# EAGLE design H21R2 (EAGLE 9.6.1)

## Sheet 1 of 2
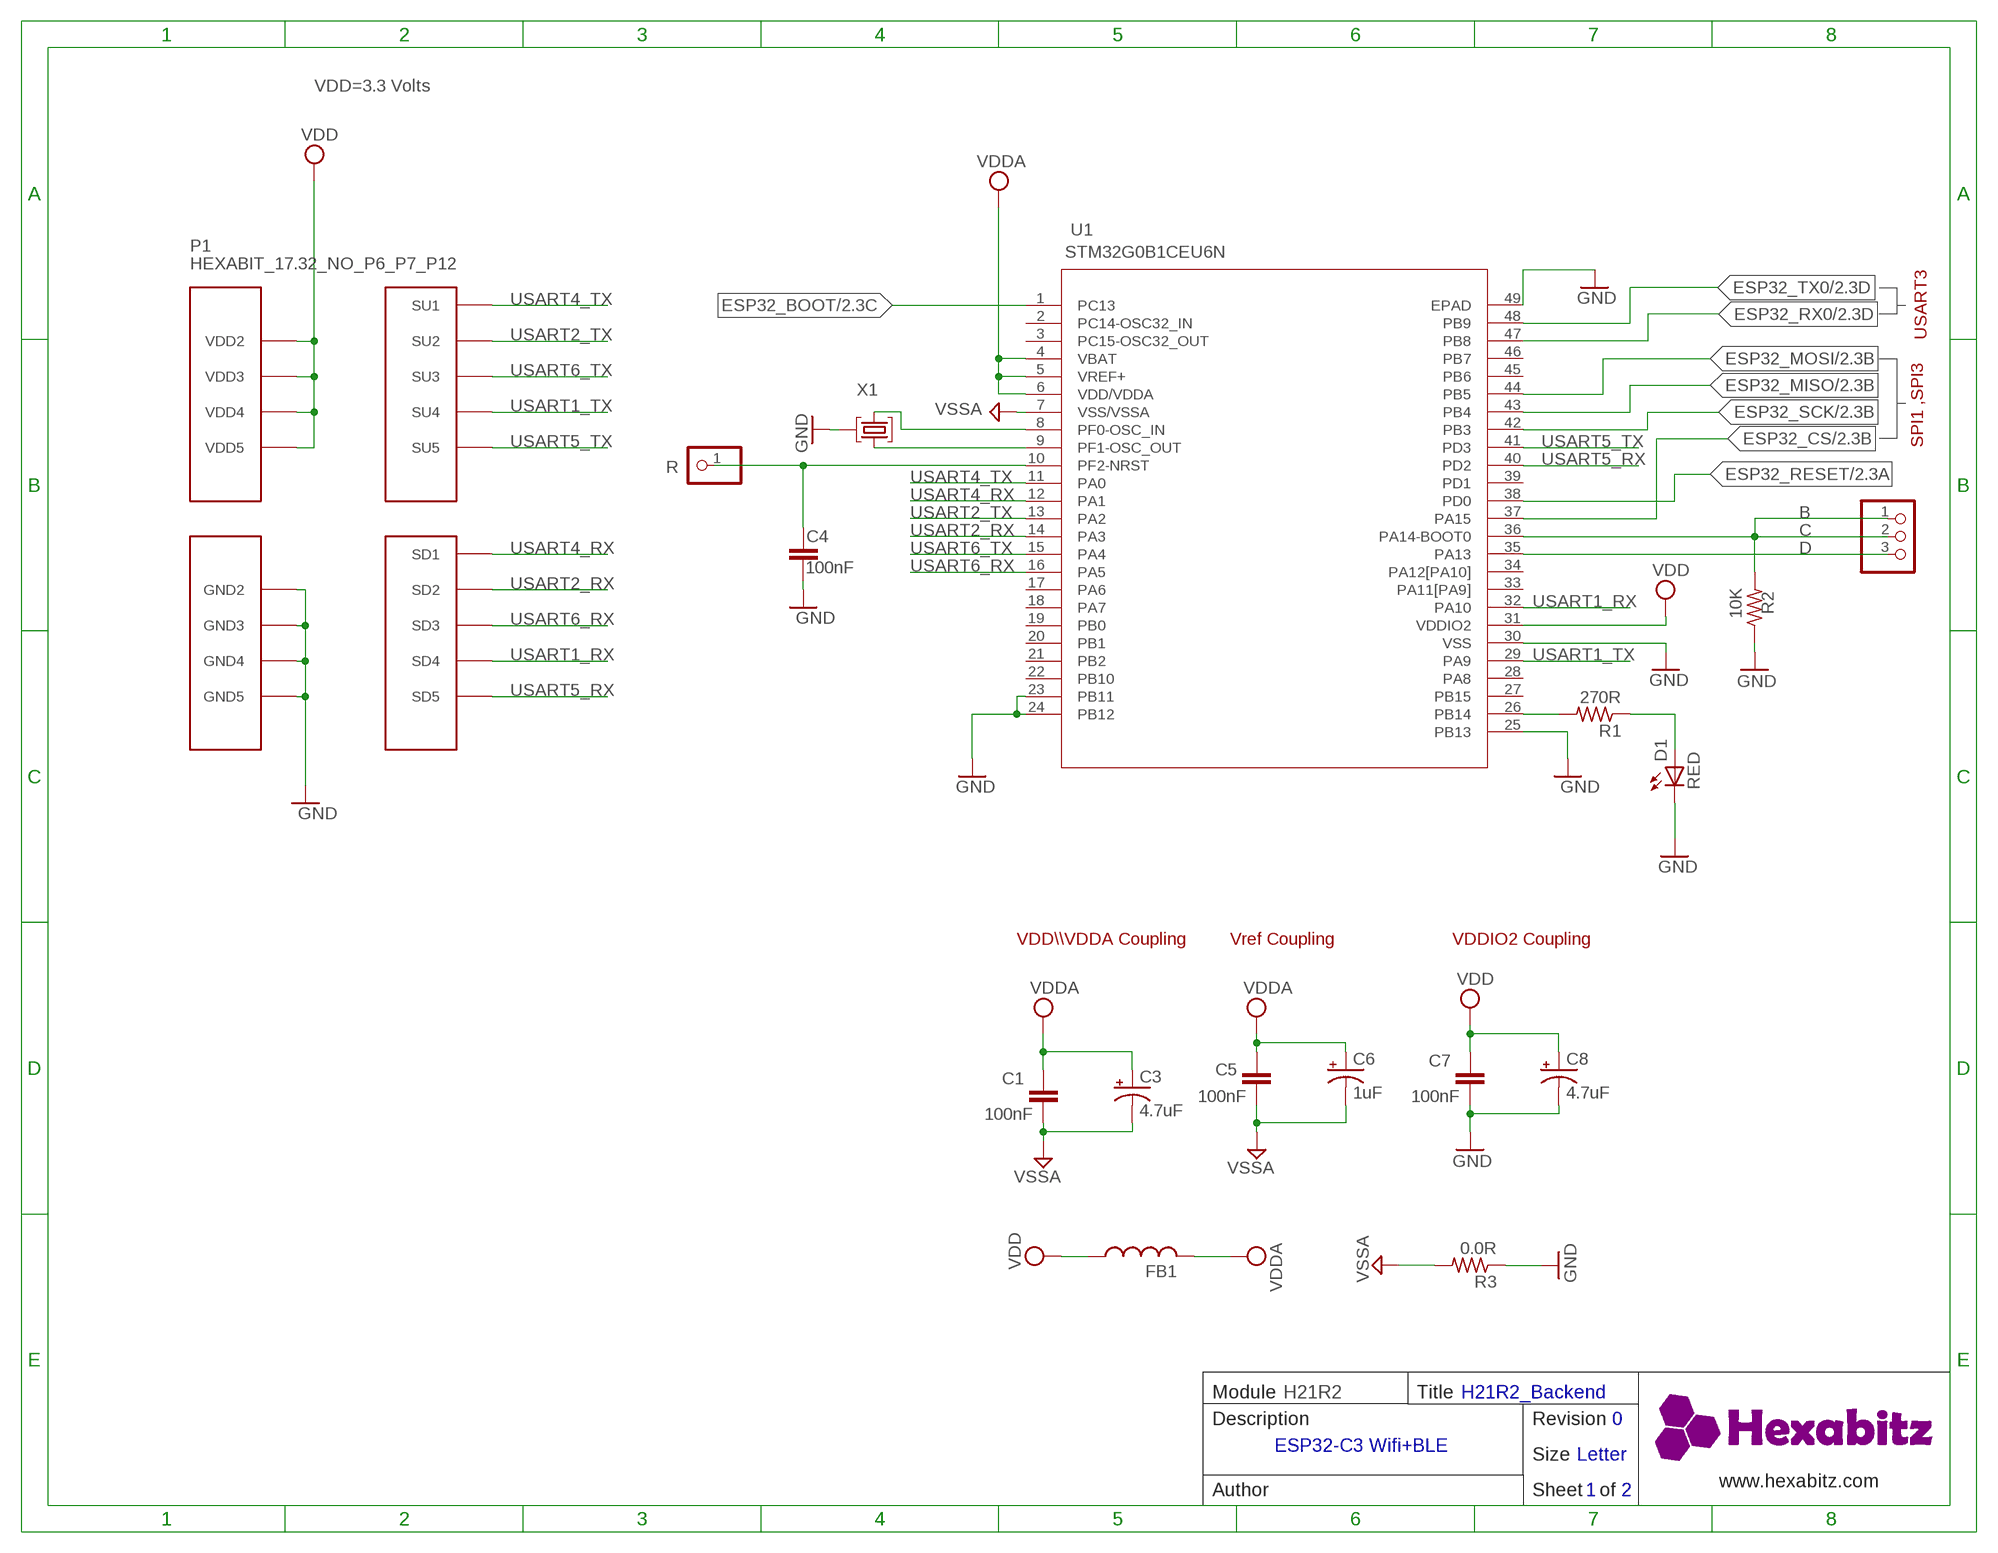
[diagram p0: schematic, sheet 1]

### Parts
C1  100nF  C-0603  [C-0603]
C3  4.7uF  C-0805-POL  [C-0805-POL]
C4  100nF  C-0603  [C-0603]
C5  100nF  C-0603  [C-0603]
C6  1uF  C-0805-POL  [C-0805-POL]
C7  100nF  C-0603  [C-0603]
C8  4.7uF  C-0805-POL  [C-0805-POL]
D1  RED  VLMS1300-GS08  [VLMS1300-GS08]
FB1  FB-TDK_MMZ1608Y300B  [FB-TDK_MMZ1608Y300B]
JP1  PINHD-1X3  [1X03]
P1  HEXABIT_17.32_NO_P6_P7_P12  [HEXABIT_17.32_NO_P6_P7_P12]
R  PINHD-1X1  [1X01]
R1  270R  R-0603  [R-0603]
R2  10K  R-0603  [R-0603]
R3  0.0R  R-0603  [R-0603]
U1  STM32G0B1CEU6N  [HEXABITZ_ICS_QFN_B1CEU6_STM-L]
X1  8MHZ  XTALL_CSTCE8M00G52  [XTALL_CSTCE8M00G52]

### Nets
C: JP1.1 JP1.2 R2.2 U1.36(PA14-BOOT0)
D: JP1.3 U1.35(PA13)
ESP32_BOOT: U1.1(PC13) ; also sheet 2
ESP32_CS: U1.37(PA15) ; also sheet 2
ESP32_MISO: U1.43(PB4) ; also sheet 2
ESP32_MOSI: U1.44(PB5) ; also sheet 2
ESP32_RESET: U1.38(PD0) ; also sheet 2
ESP32_RX0: U1.47(PB8) ; also sheet 2
ESP32_SCK: U1.42(PB3) ; also sheet 2
ESP32_TX0: U1.48(PB9) ; also sheet 2
GND: C4.1 C7.1 C8.2(-) D1.C P1.PAD_PD8(GND2) P1.PAD_PD9(GND3) P1.PAD_PD10(GND4) P1.PAD_PD11(GND5) R2.1 R3.1 U1.23(PB11) U1.24(PB12) U1.25(PB13) U1.30(VSS) U1.49(EPAD) X1.P$2 ; also sheet 2
N$1: U1.8(PF0-OSC_IN) X1.P$1
N$2: U1.9(PF1-OSC_OUT) X1.P$3
N$12: C4.2 R.1 U1.10(PF2-NRST)
N$17: R1.2 U1.26(PB14)
N$19: D1.A R1.1
USART1_RX: P1.PAD_PD4(SD4) U1.32(PA10)
USART1_TX: P1.PAD_PU4(SU4) U1.29(PA9)
USART2_RX: P1.PAD_PD2(SD2) U1.14(PA3)
USART2_TX: P1.PAD_PU2(SU2) U1.13(PA2)
USART4_RX: P1.PAD_PD1(SD1) U1.12(PA1)
USART4_TX: P1.PAD_PU1(SU1) U1.11(PA0)
USART5_RX: P1.PAD_PD5(SD5) U1.40(PD2)
USART5_TX: P1.PAD_PU5(SU5) U1.41(PD3)
USART6_RX: P1.PAD_PD3(SD3) U1.16(PA5)
USART6_TX: P1.PAD_PU3(SU3) U1.15(PA4)
VDD: C7.2 C8.1(+) FB1.1 P1.PAD_PU8(VDD2) P1.PAD_PU9(VDD3) P1.PAD_PU10(VDD4) P1.PAD_PU11(VDD5) U1.31(VDDIO2) ; also sheet 2
VDDA: C1.2 C3.1(+) C5.2 C6.1(+) FB1.2 U1.4(VBAT) U1.5(VREF+) U1.6(VDD/VDDA)
VSSA: C1.1 C3.2(-) C5.1 C6.2(-) R3.2 U1.7(VSS/VSSA)
Unconnected: U1.2(PC14-OSC32_IN) U1.3(PC15-OSC32_OUT) U1.17(PA6) U1.18(PA7) U1.19(PB0) U1.20(PB1) U1.21(PB2) U1.22(PB10) U1.27(PB15) U1.28(PA8) U1.33(PA11[PA9]) U1.34(PA12[PA10]) U1.39(PD1) U1.45(PB6) U1.46(PB7)

### Notes on the sheet
- VDD=3.3 Volts
- USART3
- SPI1 ,SPI3
- B
- VDD\\\VDDA Coupling | Vref Coupling | VDDIO2 Coupling
- Module | H21R2 | Title | H21R2_Backend
- Description | Revision | 0
- ESP32-C3 Wifi+BLE
- Size | Letter
- www.hexabitz.com
- Author | Sheet   of | 1 | 2
- C:/Users/Admin/Desktop/logodraft.bmp

## Sheet 2 of 2
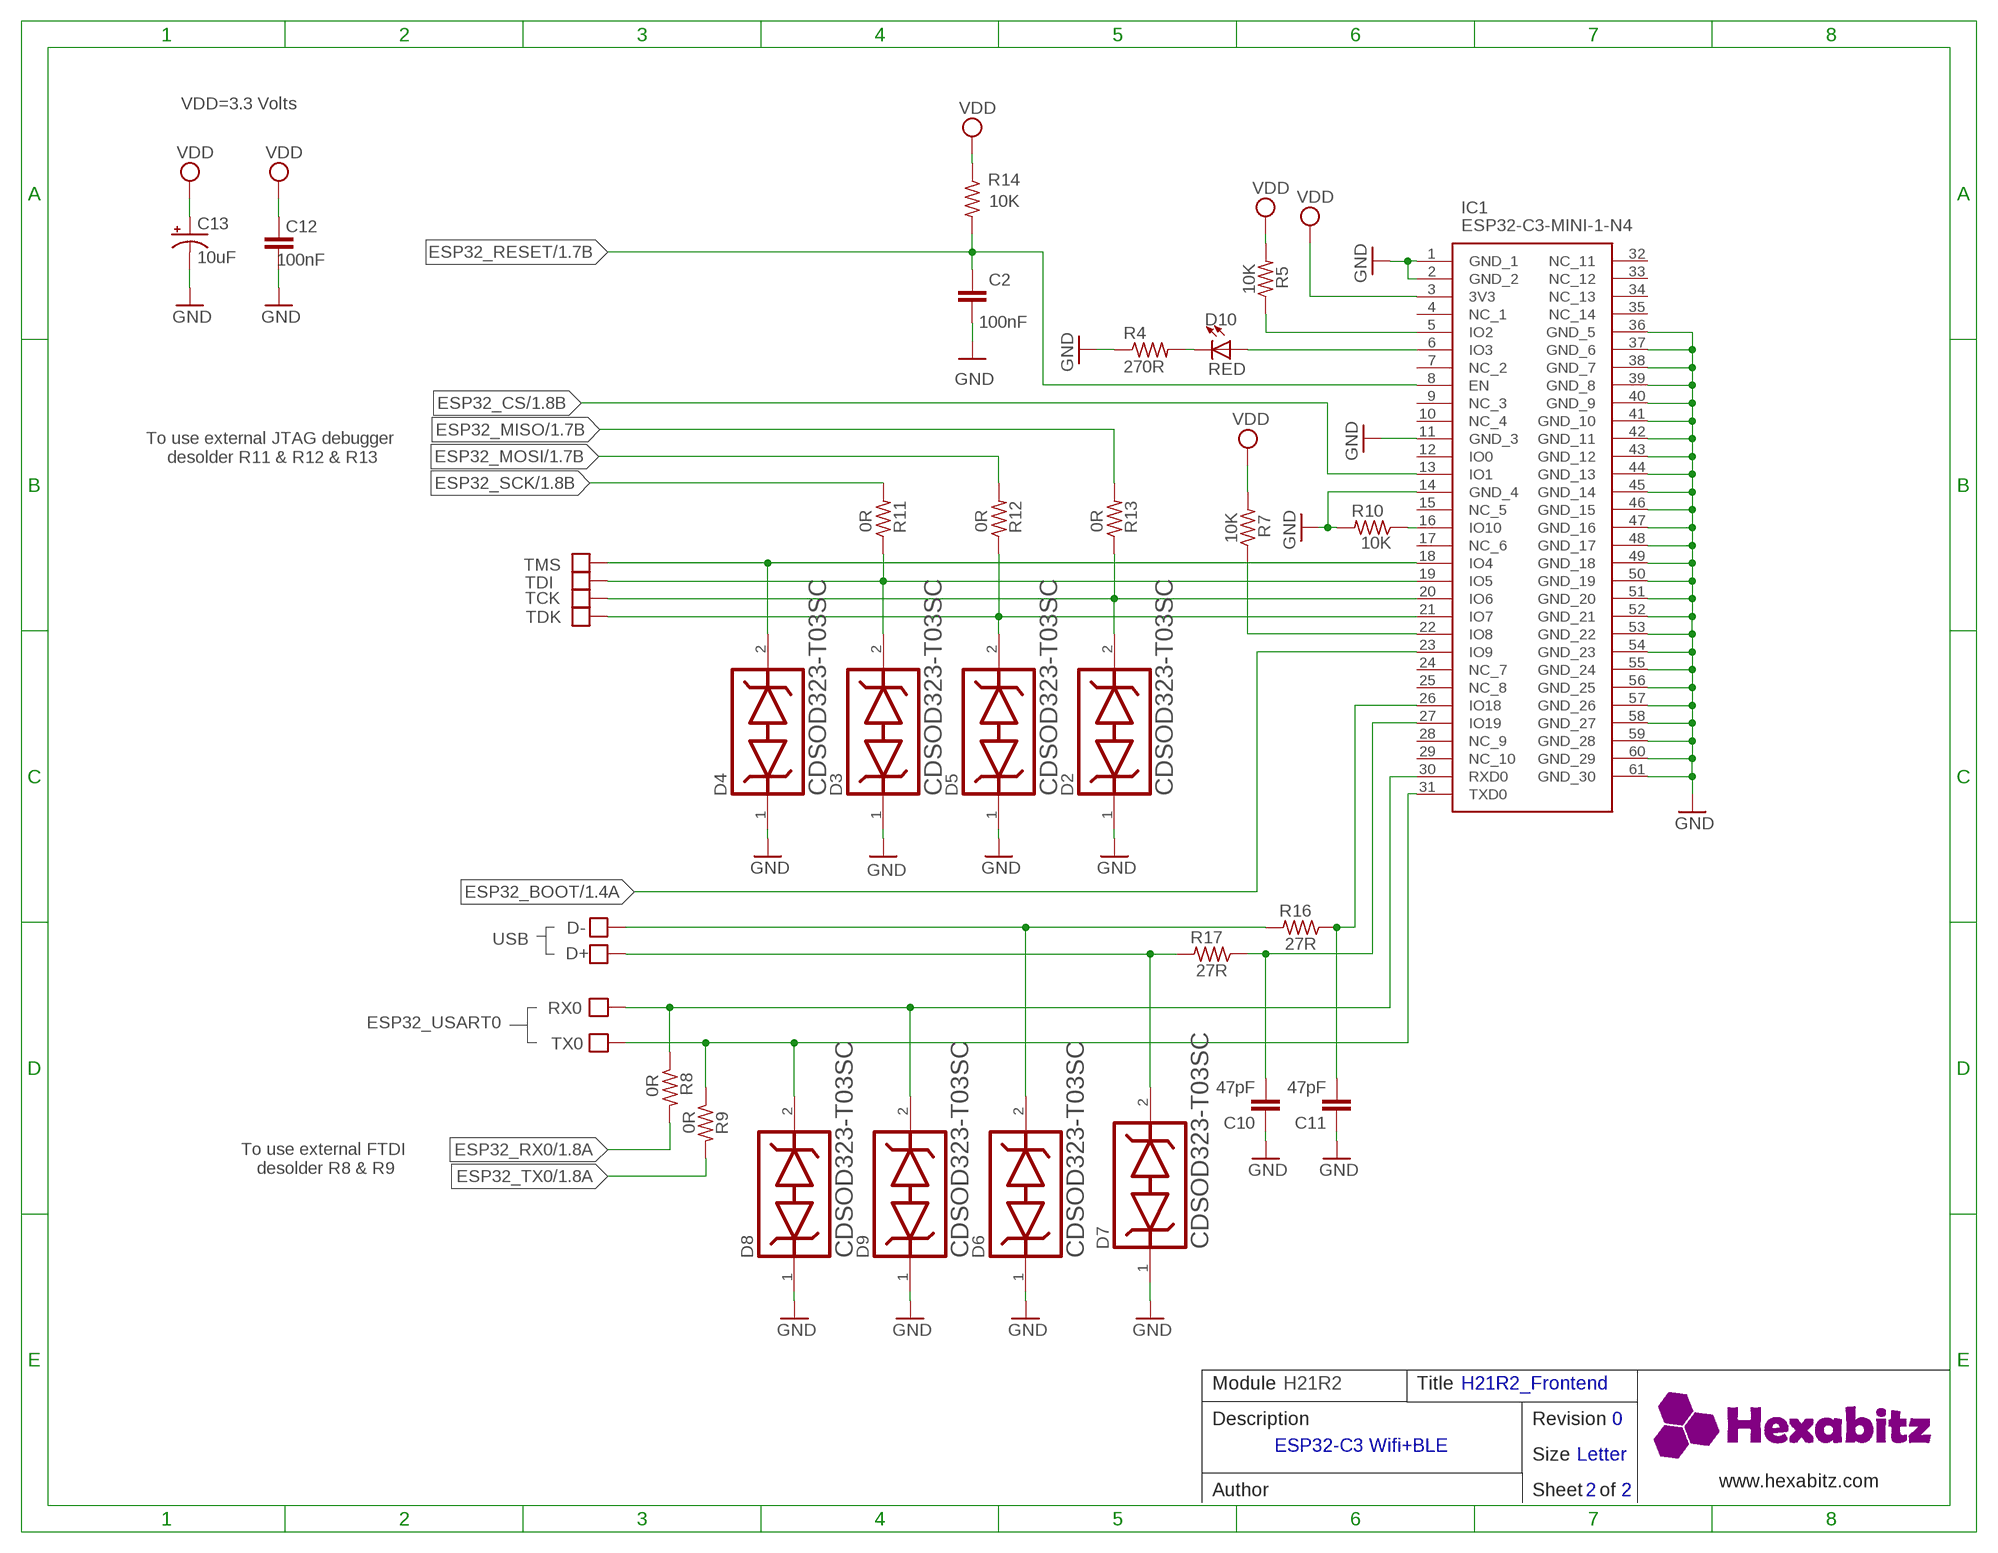
[diagram p1: schematic, sheet 2]

### Parts
C2  100nF  C-0603  [C-0603]
C10  47pF  C-0603  [C-0603]
C11  47pF  C-0603  [C-0603]
C12  100nF  C-0603  [C-0603]
C13  10uF  C-1210-POL  [C-1210-POL]
D2  BOURNS_CDSOD323-T03SCBOURNS_CDSOD323-T03SC_0_0  [BOURNS_CDSOD323-T03SC_0]
D3  BOURNS_CDSOD323-T03SCBOURNS_CDSOD323-T03SC_0_0  [BOURNS_CDSOD323-T03SC_0]
D4  BOURNS_CDSOD323-T03SCBOURNS_CDSOD323-T03SC_0_0  [BOURNS_CDSOD323-T03SC_0]
D5  BOURNS_CDSOD323-T03SCBOURNS_CDSOD323-T03SC_0_0  [BOURNS_CDSOD323-T03SC_0]
D6  BOURNS_CDSOD323-T03SCBOURNS_CDSOD323-T03SC_0_0  [BOURNS_CDSOD323-T03SC_0]
D7  BOURNS_CDSOD323-T03SCBOURNS_CDSOD323-T03SC_0_0  [BOURNS_CDSOD323-T03SC_0]
D8  BOURNS_CDSOD323-T03SCBOURNS_CDSOD323-T03SC_0_0  [BOURNS_CDSOD323-T03SC_0]
D9  BOURNS_CDSOD323-T03SCBOURNS_CDSOD323-T03SC_0_0  [BOURNS_CDSOD323-T03SC_0]
D10  RED  VLMS1300-GS08  [VLMS1300-GS08]
D+  PAD4  [PAD4]
D-  PAD4  [PAD4]
IC1  ESP32-C3-MINI-1-N4  [ESP32C3MINI1N4]
R4  270R  R-0603  [R-0603]
R5  10K  R-0603  [R-0603]
R7  10K  R-0603  [R-0603]
R8  0R  R-0603  [R-0603]
R9  0R  R-0603  [R-0603]
R10  10K  R-0603  [R-0603]
R11  0R  R-0402  [R-0402]
R12  0R  R-0402  [R-0402]
R13  0R  R-0402  [R-0402]
R14  10K  R-0603  [R-0603]
R16  27R  R-0603  [R-0603]
R17  27R  R-0603  [R-0603]
RX0  PAD4  [PAD4]
TCK  PAD4  [PAD4]
TDI  PAD4  [PAD4]
TDK  PAD4  [PAD4]
TMS  PAD4  [PAD4]
TX0  PAD4  [PAD4]

### Nets
D_N: D6.2 D-.P$1 R16.2
D_P: D7.2 D+.P$1 R17.2
DATA_N: C11.2 IC1.26(IO18) R16.1
DATA_P: C10.2 IC1.27(IO19) R17.1
ESP32_BOOT: IC1.23(IO9) ; also sheet 1
ESP32_CS: IC1.13(IO1) ; also sheet 1
ESP32_MISO: R13.2 ; also sheet 1
ESP32_MOSI: R12.2 ; also sheet 1
ESP32_RESET: C2.2 IC1.8(EN) R14.2 ; also sheet 1
ESP32_RX0: R8.2 ; also sheet 1
ESP32_SCK: R11.2 ; also sheet 1
ESP32_TX0: R9.2 ; also sheet 1
GND: C2.1 C10.1 C11.1 C12.1 C13.2(-) D2.1 D3.1 D4.1 D5.1 D6.1 D7.1 D8.1 D9.1 IC1.1(GND_1) IC1.2(GND_2) IC1.11(GND_3) IC1.14(GND_4) IC1.36(GND_5) IC1.37(GND_6) IC1.38(GND_7) IC1.39(GND_8) IC1.40(GND_9) IC1.41(GND_10) IC1.42(GND_11) IC1.43(GND_12) IC1.44(GND_13) IC1.45(GND_14) IC1.46(GND_15) IC1.47(GND_16) IC1.48(GND_17) IC1.49(GND_18) IC1.50(GND_19) IC1.51(GND_20) IC1.52(GND_21) IC1.53(GND_22) IC1.54(GND_23) IC1.55(GND_24) IC1.56(GND_25) IC1.57(GND_26) IC1.58(GND_27) IC1.59(GND_28) IC1.60(GND_29) IC1.61(GND_30) R4.1 R10.2 ; also sheet 1
N$3: D4.2 IC1.18(IO4) TMS.P$1
N$4: IC1.22(IO8) R7.1
N$5: D10.C R4.2
N$6: D9.2 IC1.30(RXD0) R8.1 RX0.P$1
N$7: D8.2 IC1.31(TXD0) R9.1 TX0.P$1
N$9: IC1.16(IO10) R10.1
N$10: D2.2 IC1.20(IO6) R13.1 TCK.P$1
N$11: D5.2 IC1.21(IO7) R12.1 TDK.P$1
N$14: D10.A IC1.6(IO3)
N$15: IC1.5(IO2) R5.1
N$18: D3.2 IC1.19(IO5) R11.1 TDI.P$1
VDD: C12.2 C13.1(+) IC1.3(3V3) R5.2 R7.2 R14.1 ; also sheet 1
Unconnected: IC1.4(NC_1) IC1.7(NC_2) IC1.9(NC_3) IC1.10(NC_4) IC1.12(IO0) IC1.15(NC_5) IC1.17(NC_6) IC1.24(NC_7) IC1.25(NC_8) IC1.28(NC_9) IC1.29(NC_10) IC1.32(NC_11) IC1.33(NC_12) IC1.34(NC_13) IC1.35(NC_14)

### Notes on the sheet
- VDD=3.3 Volts
- To use external JTAG debugger
   desolder R11 & R12 & R13
- USB
- ESP32_USART0
- To use external FTDI
   desolder R8 & R9
- Module | H21R2 | Title | H21R2_Frontend
- Description | Revision | 0
- ESP32-C3 Wifi+BLE
- Size | Letter
- www.hexabitz.com
- Author | Sheet   of | 2 | 2

## Library data of the parts
C1 C2 C5 C7 C10-C12 = HEXABITZ_RCLS:C-0603: CAP CER 10% X7R 0603; CAPACITANCE: 100nF; MFN: AVX CORPORATION; MPN: '0603YC104K4T2A; OCTOPART_URL: 'https://octopart.com/0603yc104k4t2a-avx+interconnect+%2F+elco-8120651; TOLERANCE: 10%; VOLTAGE_RATING: 16.0 V
C3 = HEXABITZ_RCLS:C-0805-POL: Cap Tant Solid SMD 2012; CAPACITANCE: 4.7uF; MFN: 'Panasonic; MPN: '10TPU4R7MSI; OCTOPART_URL: https://octopart.com/10tpu4r7msi-panasonic-29487748?r=sp; TOLERANCE: 20%; VOLTAGE_RATING: 10.0 V
C4 = HEXABITZ_RCLS:C-0603: CAP CER 10% X7R 0603; CAPACITANCE: 100nF; MFN: AVX CORPORATION; MPN: 0603YC104K4T2A; OCTOPART_URL: 'https://octopart.com/0603yc104k4t2a-avx+interconnect+%2F+elco-8120651; TOLERANCE: 10%; VOLTAGE_RATING: 16.0 V
C6 = HEXABITZ_RCLS:C-0805-POL: Cap Tant Solid SMD 2012; CAPACITANCE: 4.7uF; MFN: 'YAGEO [VA]; MPN: 'CC0805KKX7R7BB105; OCTOPART_URL: 'https://octopart.com/cc0805kkx7r7bb105-yageo-8376555?r=sp; TOLERANCE: 20%; VOLTAGE_RATING: 10.0 V
C8 = HEXABITZ_RCLS:C-0805-POL: Cap Tant Solid SMD 2012; CAPACITANCE: 1.00uF; MFN: 'Panasonic; MPN: '10TPU4R7MSI; OCTOPART_URL: https://octopart.com/10tpu4r7msi-panasonic-29487748?r=sp; TOLERANCE: 10%; VOLTAGE_RATING: 16.0 V
C13 = HEXABITZ_RCLS:C-1210-POL: Cap Tant Solid SMD 1210 Pol
D1 D10 = HEXABITZ_USER_INTERFACE_PARTS:VLMS1300-GS08: Red 0603 130° Clear 54 mcd 2 V Surface Mount ChipLED ; Octopart Url : http://octopart.com/vlms1300-gs08-vishay-21709201; MFN: Vishay; MPN: VLMS1300-GS08; OCTOPART_URL: https://octopart.com/vlms1300-gs08-vishay-21709201?r=sp&s=0nXJNjGsSbWwqfqWlZv0EA
D2-D9 = HEXABITZ_RCLS:BOURNS_CDSOD323-T03SC: CDSOD323-TxxSC - TVS Diode Series; DESCRIPTION: Dio Tvs Vwm 03V 500W Bidir Sod323 / Tape & Reel - 7" Reel; MFN: Bourns; MPN: CDSOD323-T03SC; OCTOPART_URL: https://octopart.com/cdsod323-t03sc-bourns-10487153?r=sp
D+ D- RX0 TCK TDI TDK TMS TX0 = HEXABITZ_CONNECTION_PARTS:PAD4
FB1 = HEXABITZ_RCLS:FB-TDK_MMZ1608Y300B: Ferrite Beads Multi-Layer 30Ohm 25% 100MHz 1.5A 50mOhm DCR 0603; MFN: TDK; MPN: MMZ1608Y300BTA00; OCTOPART_URL: https://octopart.com/mmz1608y300bta00-tdk-7906990?r=sp
IC1 = HEXABITZ_ICs:ESP32-C3-MINI-1-N4: SMD MODULE, ESP32-C3FN4, PCB ANT Source: Datasheet <https://www.mouser.com/datasheet/2/891/Espressif_ESP32_C3_MINI_1_Datasheet-2006822.pdf>; DESCRIPTION: SMD MODULE, ESP32-C3FN4, PCB ANT; HEIGHT: 2.55mm; MANUFACTURER_NAME: Espressif Systems; MANUFACTURER_PART_NUMBER: ESP32-C3-MINI-1-N4; MOUSER_PART_NUMBER: 356-ESP32-C3-MINI1N4; MOUSER_PRICE-STOCK: https://www.mouser.co.uk/ProductDetail/Espressif-Systems/ESP32-C3-MINI-1-N4?qs=stqOd1AaK7%252B%2FpH3qqyGehA%3D%3D
JP1 = pinhead:PINHD-1X3: PIN HEADER
P1 = hexabitz_connectors:HEXABIT_?_NO_P6_P7_P12: Hexabitz Hexagon Module Connector Hexagon side length = 17.32mm. The following ports are removed: P6 P7 P12
R = HEXABITZ_USER_INTERFACE_PARTS:PINHD-1X1: PIN HEADER; MFN: TE Connectivity; MPN: 87227-1; OCTOPART_URL: https://octopart.com/87227-1-te+connectivity-39512052?r=sp
R1 R4 = HEXABITZ_RCLS:R-0603: Thick Film Resistors - SMD 0603; MFN: 'Panasonic; MPN: 'ERJ-3GEYJ271V; OCTOPART_URL: https://octopart.com/erj-3geyj271v-panasonic-55560546?r=sp; RESISTANCE: 270R
R2 = HEXABITZ_RCLS:R-0603: Thick Film Resistors - SMD 0603; MFN: Vishay; MPN: '060300J0103T5E; OCTOPART_URL: https://octopart.com/search?q=060300J0103T5E&currency=USD&specs=0; RESISTANCE: 10K
R3 R5 R7-R10 R14 R16 R17 = HEXABITZ_RCLS:R-0603: Thick Film Resistors - SMD 0603; MFN: YAGEO [VR]; MPN: RC0603JR-070RL; OCTOPART_URL: https://octopart.com/rc0603jr-070rl-yageo-1241539?r=sp; RESISTANCE: 0R
R11-R13 = HEXABITZ_RCLS:R-0402: Thick Film Resistors - SMD 0603; MFN: YAGEO [VR]; MPN: RC0603JR-070RL; OCTOPART_URL: https://octopart.com/rc0603jr-070rl-yageo-1241539?r=sp; RESISTANCE: 0R
U1 = HEXABITZ_ICs:STM32G0B1CEU6N
X1 = HEXABITZ_OTHER_PARTS:XTALL_CSTCE8M00G52: MURATA CSTCE8M00G52-R0 RESONATOR, SMD, 8MHZ ; Octopart Url : https://octopart.com/cstce8m00g52-r0-murata-7145559; MFN: Murata; MPN: CSTNE8M00G550000R0; OCTOPART_URL: https://octopart.com/cstne8m00g550000r0-murata-91406934?r=sp

## Board
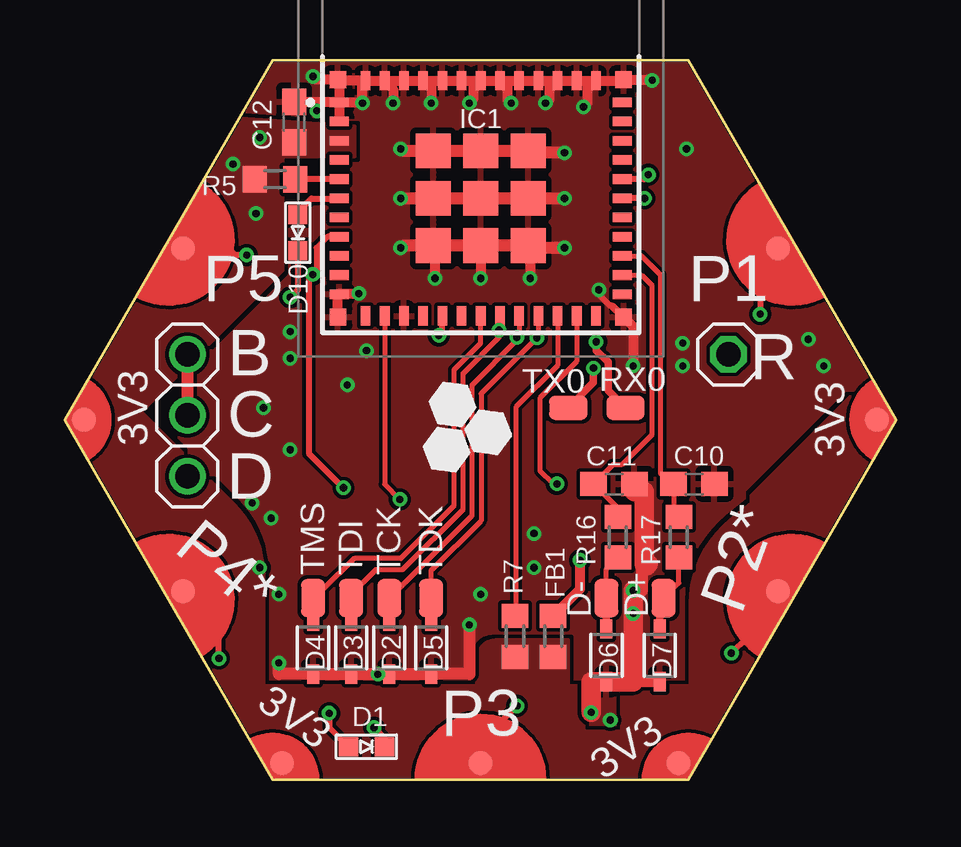
[diagram p2: board, top side]
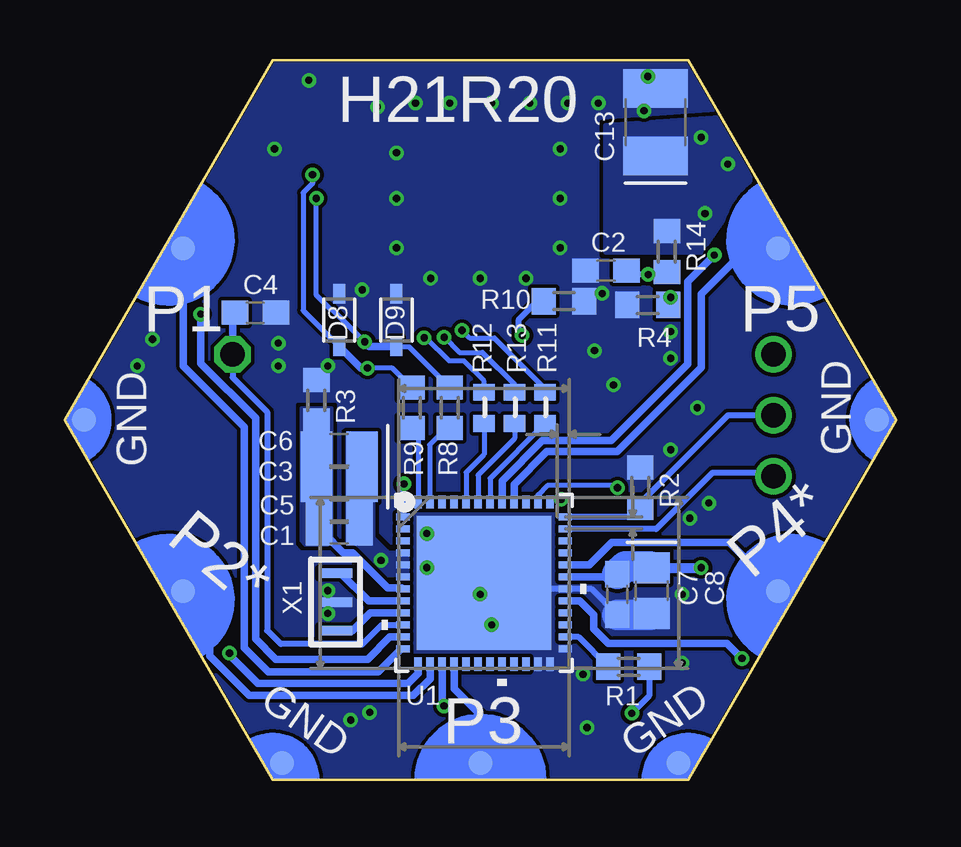
[diagram p3: board, bottom side, seen from below]

Size 34.64 x 30 mm. Coordinates in mm from the lower left corner, seen from the top.
Copper layers (1*16): Top 0.035mm / dielectric 1.5mm / Bottom 0.035mm
Design rules "2_layer *": minimum track width 6mil, minimum drill 10mil, track to track 6mil, track to pad 6mil, pad to pad 6mil, via to via 6mil, smd to smd 0mil, copper to edge 1mil, drill to drill 8mil, minimum pad ring 10mil, minimum via ring 6mil, stop-mask expansion 2mil, vias tented up to drill 15mil, thermal gap 10mil

### Footprints (pad centres in the part's own frame; a part is rotated, then mirrored left to right if it is on the bottom)
C-0603 = smd 1.1 x 1: 1 -0.85,0; 2 0.85,0
C-0805-POL = smd 1.3 x 1.5: 1 -0.95,0; 2 0.95,0
C-1210-POL = smd 1.6 x 2.7: 1 -1.4,0; 2 1.4,0
VLMS1300-GS08 = smd 0.8 x 0.8: A 0,0.75; C 0,-0.75
BOURNS_CDSOD323-T03SC_0 = smd 0.8 x 0.5: 1 -1.1,0; 2 1.1,0
PAD4 = smd 1.6 x 1: P$1 0,0
FB-TDK_MMZ1608Y300B = smd 1 x 1.1: 1 -0.85,0; 2 0.85,0
ESP32C3MINI1N4 = smd 0.8 x 0.4: 1 -5.9,4; 2 -5.9,3.2; 3 -5.9,2.4; 4 -5.9,1.6; 5 -5.9,0.8; 6 -5.9,0; 7 -5.9,-0.8; 8 -5.9,-1.6; 9 -5.9,-2.4; 10 -5.9,-3.2; 11 -5.9,-4; 25 5.9,-4; 26 5.9,-3.2; 27 5.9,-2.4; 28 5.9,-1.6; 29 5.9,-0.8; 30 5.9,0; 31 5.9,0.8; 32 5.9,1.6; 33 5.9,2.4; 34 5.9,3.2; 35 5.9,4 | smd 0.4 x 0.8: 12 -4.8,-4.9; 13 -4,-4.9; 14 -3.2,-4.9; 15 -2.4,-4.9; 16 -1.6,-4.9; 17 -0.8,-4.9; 18 0,-4.9; 19 0.8,-4.9; 20 1.6,-4.9; 21 2.4,-4.9; 22 3.2,-4.9; 23 4,-4.9; 24 4.8,-4.9; 36 4.8,4.9; 37 4,4.9; 38 3.2,4.9; 39 2.4,4.9; 40 1.6,4.9; 41 0.8,4.9; 42 0,4.9; 43 -0.8,4.9; 44 -1.6,4.9; 45 -2.4,4.9; 46 -3.2,4.9; 47 -4,4.9; 48 -4.8,4.9 | smd 1.45 x 1.45: 49 0,0; 50 1.975,1.975; 51 0,1.975; 52 -1.975,1.975; 53 -1.975,0; 54 -1.975,-1.975; 55 0,-1.975; 56 1.975,-1.975; 57 1.975,0 | smd 0.7 x 0.7: 58 -5.95,4.95; 59 -5.95,-4.95; 60 5.95,-4.95; 61 5.95,4.95
1X03 = drill 1.016: 1 -2.54,0; 2 0,0; 3 2.54,0
HEXABIT_17.32_NO_P6_P7_P12 = smd 1 x 1 bottom: PAD_PD1 12.39,7.15; PAD_PD2 12.39,-7.15; PAD_PD3 0,-14.31; PAD_PD4 -12.39,-7.15; PAD_PD5 -12.39,7.15; PAD_PD8 16.52,0; PAD_PD9 8.26,-14.31; PAD_PD10 -8.26,-14.31; PAD_PD11 -16.52,0 | smd 1 x 1: PAD_PU1 12.39,7.15; PAD_PU2 12.39,-7.15; PAD_PU3 0,-14.31; PAD_PU4 -12.39,-7.15; PAD_PU5 -12.39,7.15; PAD_PU8 16.52,0; PAD_PU9 8.26,-14.31; PAD_PU10 -8.26,-14.31; PAD_PU11 -16.52,0
1X01 = drill 1.016 octagon: 1 0,0
R-0603 = smd 1 x 1.1: 1 -0.85,0; 2 0.85,0
R-0402 = smd 0.7 x 0.9: 1 -0.65,0; 2 0.65,0
HEXABITZ_ICS_QFN_B1CEU6_STM-L = smd 0.55 x 0.297: 1 -3.38,2.751; 2 -3.38,2.251; 3 -3.38,1.75; 4 -3.38,1.25; 5 -3.38,0.75; 6 -3.38,0.25; 7 -3.38,-0.25; 8 -3.38,-0.75; 9 -3.38,-1.25; 10 -3.38,-1.75; 11 -3.38,-2.251; 12 -3.38,-2.751; 25 3.38,-2.751; 26 3.38,-2.251; 27 3.38,-1.75; 28 3.38,-1.25; 29 3.38,-0.75; 30 3.38,-0.25; 31 3.38,0.25; 32 3.38,0.75; 33 3.38,1.25; 34 3.38,1.75; 35 3.38,2.251; 36 3.38,2.751 | smd 0.297 x 0.55: 13 -2.751,-3.38; 14 -2.251,-3.38; 15 -1.75,-3.38; 16 -1.25,-3.38; 17 -0.75,-3.38; 18 -0.25,-3.38; 19 0.25,-3.38; 20 0.75,-3.38; 21 1.25,-3.38; 22 1.75,-3.38; 23 2.251,-3.38; 24 2.751,-3.38; 37 2.751,3.38; 38 2.251,3.38; 39 1.75,3.38; 40 1.25,3.38; 41 0.75,3.38; 42 0.25,3.38; 43 -0.25,3.38; 44 -0.75,3.38; 45 -1.25,3.38; 46 -1.75,3.38; 47 -2.251,3.38; 48 -2.751,3.38 | smd 5.6 x 5.6: 49 0,0
XTALL_CSTCE8M00G52 = smd 1.4 x 0.4: P$1 0,1.2; P$2 0,0; P$3 0,-1.2

### Placement (x,y rotation side)
C1  23.2,10.26 0 bottom
C2  12.09,21.21 0 bottom
C3  23.2,12.32 180 bottom
C4  26.7,19.47 180 bottom
C5  23.2,11.21 0 bottom
C6  23.2,13.75 180 bottom
C7  11.62,7.72 90 bottom
C8  10.19,7.88 270 bottom
C10  26.22,12.32 180 top
C11  22.89,12.32 180 top
C12  9.55,27.41 270 top
C13  10.03,27.41 90 bottom
D1  12.57,1.37 90 top
D2  13.52,5.5 90 top
D3  11.93,5.5 90 top
D4  10.35,5.5 90 top
D5  15.27,5.5 90 top
D6  22.57,5.18 90 top
D7  24.79,5.18 90 top
D8  23.2,19.15 270 bottom
D9  20.82,19.15 270 bottom
D10  9.71,22.8 0 top
D+  24.95,7.56 90 top
D-  22.57,7.56 90 top
FB1  20.35,5.97 90 top
IC1  17.33,24.23 0 top
JP1  5.11,15.18 270 top
P1  17.32,15 0 top
R  27.65,17.72 180 top
R1  11.14,4.7 180 bottom
R2  10.66,12.17 270 bottom
R3  24.16,15.82 270 bottom
R4  10.35,19.79 0 bottom
R5  8.76,25.02 180 top
R7  18.76,5.97 270 top
R8  18.6,15.5 270 bottom
R9  20.19,15.5 270 bottom
R10  13.84,19.94 0 bottom
R11  14.63,15.5 270 bottom
R12  17.17,15.5 270 bottom
R13  15.9,15.5 270 bottom
R14  9.55,22.01 270 bottom
R16  23.05,10.1 270 top
R17  25.59,10.1 270 top
RX0  23.36,15.5 180 top
TCK  13.52,7.56 90 top
TDI  11.93,7.56 270 top
TDK  15.27,7.56 90 top
TMS  10.35,7.56 90 top
TX0  20.98,15.5 0 top
U1  17.17,8.2 0 bottom
X1  23.36,7.4 0 bottom

### Tracks (layer width: path | path; a pad name or v marks a point on that pad's centre or on a via)
C
  Top 0.508: JP1.1 JP1.2
  Bottom 0.254: JP1.2 7.01,15.18 10.66,11.53 R2.2 11.03,10.95 U1.36
D
  Bottom 0.254: JP1.3 5.27,12.8 7.65,12.8 10,10.45 U1.35
D_N
  Top 0.203: D-.P$1 22.57,8.78 R16.2
  Top 0.305: D-.P$1 D6.2
D_P
  Top 0.203: D+.P$1 25.59,8.2 R17.2
  Top 0.305: D+.P$1 24.79,7.4 D7.2
DATA_N
  Top 0.203: IC1.26 24.04,21.03 24.47,20.59 24.47,14.39 23.2,13.12 22.83,13.12 C11.2 23.05,11.32 R16.1
DATA_P
  Top 0.203: IC1.27 24.04,21.83 24.83,21.04 24.83,12.77 25.27,12.32 C10.2 25.37,11.17 R17.1
ESP32_BOOT  (via drill 0.3 pad 0.55)
  Top 0.203: IC1.23 21.33,17.44 19.8,15.91 19.8,12.87 20.35,12.32 v20.51,12.32
  Bottom 0.254: v20.51,12.32 20.57,12.26 20.57,10.95 U1.1
ESP32_CS  (via drill 0.3 pad 0.55)
  Top 0.203: v13.96,11.68 13.33,12.32 IC1.13
  Bottom 0.254: v13.96,11.68 14.42,11.68 U1.37
ESP32_MISO
  Bottom 0.203: R13.2 15.9,14.21 17.42,12.69 U1.43
ESP32_MOSI
  Bottom 0.203: R12.2 17.17,13.56 17.92,12.81 U1.44
ESP32_RESET  (via drill 0.3 pad 0.55)
  Top 0.254: IC1.8 10.95,22.63 10.49,22.17 10.49,21.21 v10.33,21.06 10.17,20.9 10.17,13.6 v11.61,12.16
  Bottom 0.203: v11.61,12.16 11.7,12.25 14.54,12.25 14.92,11.87 U1.38
  Bottom 0.254: R14.2 10.23,21.16 v10.33,21.06 11.08,21.06 C2.2
ESP32_RX0
  Bottom 0.203: R8.2 18.76,14.65 19.44,13.97 19.44,11.59 U1.47
ESP32_SCK
  Bottom 0.203: R11.2 16.92,12.56 U1.42
ESP32_TX0
  Bottom 0.203: R9.2 19.92,14.38 U1.48
GND  (via drill 0.3 pad 0.55)
  Top 0.254: 22.84,19.73 22.81,19.75 22.71,19.75 22.25,20.21 v22.25,20.42 | v12.89,2.16 13.32,1.73 D1.C
  Top 0.305: IC1.60 22.84,19.73
  Top 0.406: IC1.48 IC1.47 | IC1.47 IC1.46 IC1.45 15.27,29.13 | 15.27,29.13 IC1.44 IC1.43 17.01,29.13 | 17.01,29.13 IC1.42 IC1.41 18.44,29.13 | 18.44,29.13 IC1.40 IC1.39 20.19,29.13 | 20.19,29.13 IC1.38 IC1.37 21.78,29.13 | 21.78,29.13 IC1.36 23.23,29.13 IC1.61 24.45,29.18 v24.47,29.15 | IC1.48 11.43,29.13 | v10.35,29.31 10.48,29.18 IC1.58 11.43,29.13 | 11.43,29.13 IC1.1 | IC1.1 IC1.2 | IC1.1 12.38,28.23 | 12.38,28.23 v12.41,28.2 | IC1.48 12.38,28.98 12.38,28.23 | IC1.47 13.68,28.78 v13.68,28.2 | 15.27,29.13 v15.27,28.2 | 17.01,29.13 17.01,28.36 v16.85,28.2 | 18.44,29.13 18.44,28.36 v18.6,28.2 | 20.19,29.13 20.19,28.36 v20.03,28.2 | 21.78,29.13 21.78,28.2 v21.62,28.04 | C12.1 11.41,28.26 IC1.1 | IC1.59 11.38,20.18 IC1.11 11.46,20.26 v12.25,20.26 | IC1.60 23.68,18.88 v23.68,17.25 | IC1.54 15.43,22.19 v15.43,20.9 | IC1.55 v17.33,20.9 | 19.39,22.17 v19.39,20.9 | D6.1 22.73,4.08 D7.1
  Top 0.508: v20.82,26.14 19.38,26.14 IC1.50 IC1.51 IC1.52 14.09,26.21 v14,26.29 | v14,24.23 IC1.53 IC1.49 IC1.57 v20.82,24.23 | v20.82,22.17 19.39,22.17 IC1.56 IC1.55 IC1.54 14.11,22.26 v14,22.17 | v16.85,6.45 16.85,4.4 D5.1 D2.1 D3.1 D4.1 8.92,4.4 v8.92,4.86 | 24.32,8.82 24.32,8.77 24.04,8.77 24.04,7.88 v23.68,7.88
  Top 0.61: 24.32,8.99 24.32,8.82
  Top 0.813: v21.93,2.8 21.93,4.08 22.73,4.08 23.68,4.08 v23.68,7.88 | C11.1 23.74,12.01 24.15,12.01 24.15,8.99 24.32,8.99
  Bottom 0.254: C7.1 12.69,7.95 16.92,7.95 U1.49
  Bottom 1.27: C7.1 10.25,6.87 C8.2
  other vias: 10.5,27.88 25.9,26.29 30.98,18.36 31.62,17.25 25.74,17.25 12.57,17.88 11.77,16.45 9.39,13.75 17.33,7.72 19.55,8.83 25.74,18.2 9.39,18.67 9.39,17.56 8.28,15.5 8.6,10.89 7.81,11.53 8.92,7.72 19.55,10.26 13.04,4.39 22.73,2.48 23.68,6.93
  pour Bottom (rank 2, no thermals): 8.6,29.95 25.9,29.95 34.48,15.02 25.9,0.1 8.76,0.1 0.03,15.02
  pour Top (rank 2): 8.76,29.95 25.9,29.95 34.48,15.02 25.9,0.1 8.76,0.1 0.03,15.02
N$1
  Bottom 0.305: U1.8 21.98,7.45 23.13,8.6 X1.P$1
N$2
  Bottom 0.305: U1.9 21.91,6.95 22.66,6.2 X1.P$3
N$3
  Top 0.203: D4.2 TMS.P$1 10.35,7.72 10.73,8.11 10.73,7.9 12.06,9.22 14,9.22 16.22,11.44 16.22,17.09 17.33,18.2 IC1.18
N$4
  Top 0.203: IC1.22 20.53,17.26 18.79,15.52 18.79,6.86 R7.1
N$5  (via drill 0.3 pad 0.55)
  Top 0.254: v9.39,20.1 9.71,20.42 D10.C
  Bottom 0.254: v9.39,20.1 9.46,19.81 R4.2
N$6  (via drill 0.3 pad 0.55)
  Top 0.254: v24.16,24.23 IC1.30
  Top 0.305: v22.14,18.25 22.14,17.89 22.64,17.4 22.64,16.23 RX0.P$1
  Bottom 0.203: D9.2 20.3,18.05 R8.1 | v22.14,18.25 23.49,19.6 23.56,19.6 24.16,20.19 v24.16,24.23
  Bottom 0.305: D9.2 21.94,18.05 v22.14,18.25
N$7  (via drill 0.3 pad 0.55)
  Top 0.254: v24.32,25.22 24.13,25.03 IC1.31
  Top 0.305: v22.03,17.15 22.03,16.55 TX0.P$1
  Bottom 0.203: R9.1 20.99,17.15 v22.03,17.15 | v24.32,25.22 24.32,24.86 24.71,24.46 24.71,19.56 D8.2
  Bottom 0.305: D8.2 22.3,17.15 v22.03,17.15
N$9  (via drill 0.3 pad 0.55)
  Top 0.254: v15.58,18.52 15.73,18.66 IC1.16
  Bottom 0.254: R10.1 14.95,19.94 15.74,19.15 15.74,18.67 v15.58,18.52
N$10  (via drill 0.3 pad 0.55)
  Top 0.203: IC1.20 18.93,18.53 v18.84,18.44 18.84,18.32 16.97,16.45 16.97,11.01 TCK.P$1 D2.2
  Bottom 0.203: v18.84,18.44 18.2,17.8 17.24,17.8 15.9,16.47 R13.1
N$11  (via drill 0.3 pad 0.55)
  Top 0.203: IC1.21 19.73,18.41 v19.67,18.41 17.34,16.09 17.34,10.79 15.27,8.71 TDK.P$1 D5.2
  Bottom 0.203: R12.1 17.17,16.61 18.01,17.45 18.63,17.45 19.6,18.41 v19.67,18.41
N$12
  Bottom 0.254: R.1 27.65,16.77 26.21,15.33 26.21,6.22 25.64,5.65 22.27,5.65 22.25,5.64 21.44,6.45 U1.10
  Bottom 0.305: C4.2 27.65,19.37 R.1
N$14
  Top 0.254: D10.A 9.71,23.66 10.28,24.23 IC1.6
N$15
  Top 0.254: IC1.5 R5.1
N$17
  Bottom 0.254: R1.2 13.23,5.95 U1.26
N$18  (via drill 0.3 pad 0.55)
  Top 0.203: D3.2 TDI.P$1 11.93,7.72 12.96,8.74 14.07,8.74 16.59,11.27 16.59,16.93 18.09,18.42 v18.09,18.73 18.13,18.77 IC1.19
  Bottom 0.203: R11.1 14.63,16.31 16.74,18.41 17.77,18.41 v18.09,18.73
N$19  (via drill 0.3 pad 0.55)
  Top 0.254: v11.01,2.76 11.01,2.17 D1.A
  Bottom 0.254: R1.1 10.29,3.49 v11.01,2.76
USART1_RX
  Bottom 0.305: P1.PAD_PD4 6.96,9.88 11.86,9.88 12.79,8.95 U1.32
USART1_TX  (via drill 0.3 pad 0.55)
  Top 0.254: v6.43,5.05 6.43,6.35 P1.PAD_PU4
  Bottom 0.305: v6.43,5.05 7.06,5.68 12.01,5.68 12.61,6.28 12.61,6.87 13.18,7.45 U1.29
USART2_RX
  Bottom 0.305: P1.PAD_PD2 28.6,6.74 28.6,5.15 26.95,3.5 20.11,3.5 19.42,4.19 U1.14
USART2_TX  (via drill 0.3 pad 0.55)
  Top 0.254: v27.77,5.27 28.41,5.91 28.06,6.17 29.19,6.73 29.71,7.63 P1.PAD_PU2
  Bottom 0.305: v27.77,5.27 27.77,5.18 26.61,4.01 20.34,4.01 19.92,4.42 U1.13
USART4_RX
  Bottom 0.305: P1.PAD_PD1 29.71,17.24 27.17,14.71 27.17,5.5 26.17,4.49 21.58,4.49 20.63,5.45 U1.12
USART4_TX  (via drill 0.3 pad 0.55)
  Top 0.254: P1.PAD_PU1 28.98,21.42 v28.98,19.41
  Bottom 0.305: v28.98,19.41 28.98,17.35 26.69,15.06 26.69,5.86 25.85,5.01 22.02,5.01 21.09,5.95 U1.11
USART5_RX
  Bottom 0.305: P1.PAD_PD5 6.2,22.15 8.11,20.24 8.11,17.19 11.62,13.68 14.55,13.68 15.92,12.3 U1.40
USART5_TX  (via drill 0.3 pad 0.55)
  Top 0.254: v7.58,21.87 7.1,21.87 6.97,21.99 5.09,21.99 P1.PAD_PU5
  Bottom 0.305: v7.58,21.87 8.69,20.75 8.69,17.32 11.87,14.13 14.74,14.13 16.42,12.45 U1.41
USART6_RX
  Bottom 0.305: P1.PAD_PD3 17.32,2.69 18.42,3.79 U1.16
USART6_TX  (via drill 0.3 pad 0.55)
  Top 0.254: v18.84,3.07 17.25,1.48 17.25,0.78 17.32,0.72 P1.PAD_PU3
  Bottom 0.305: v18.84,3.07 18.92,3.15 U1.15
VDD  (via drill 0.3 pad 0.55)
  Bottom 0.254: 11.74,8.45 C7.2
  Bottom 0.305: U1.31 11.74,8.45
  Bottom 0.406: C8.1 v8.12,8.83
  Bottom 1.27: C8.1 10.25,8.89 11.3,8.89 C7.2
  other vias: 7.01,25.66 7.96,23.59 8.12,26.77
  pour Top (no thermals): 0.98,16.77 1.77,16.77 7.02,11.52 arc-45 8.28,8.48 8.28,3.91 17.17,3.91 17.17,5.02 arc-90 17.97,5.82 20.98,5.82 20.98,3.91 21.62,3.91 21.62,2.01 23.2,2.01 23.2,3.91 26.06,3.91 26.06,7.31 arc-51 27.73,10.82 28.6,11.53 28.6,11.85 33.68,16.93 34.63,15.02 25.9,-0.06 8.6,0.1 0.03,15.02
  pour Top (no thermals): 12.09,27.25 12.09,25.98 9.08,25.98 9.08,23.12 9.08,21.21 3.68,15.82 1.93,14.07 0.66,14.07 0.03,15.02 7.33,27.56
  pour Bottom (no thermals): 12.09,27.25 12.09,25.02 12.09,22.01 8.12,22.01 6.06,25.02 7.33,27.56
VDDA  (via drill 0.3 pad 0.55)
  Top 0.406: FB1.2 21.47,7.95 v21.47,9.14
  pour Bottom (no thermals): 20.35,9.47 20.35,8.51 21.14,8.51 21.62,8.51 22.89,9.78 22.89,14.39 21.78,14.39 21.78,10.1 21.46,9.78 21.14,9.47
VSSA
  Bottom 0.305: U1.7 20.6,7.99 21.18,7.99 22.64,9.46 23.03,9.46 23.84,10.26 C1.1
  pour Bottom (no thermals): 23.52,15.5 23.52,9.94 23.68,9.78 24.63,9.78 24.79,9.94 24.79,15.5

### Text on the board
tPlace: P5 | P1 | 3V3 | 3V3 | P4* | P2* | 3V3 | P3 | 3V3
bPlace: H21R20 | P5 | P1 | GND | GND | P4* | P2* | GND | P3 | GND
tNames: R | B | C | D